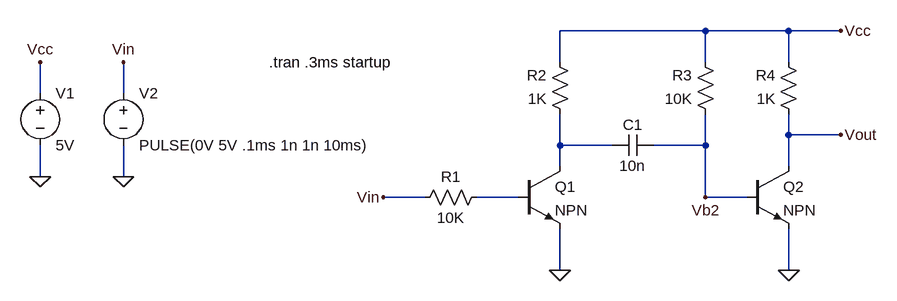
[diagram p0: schematic figure-2.11-pulse-generator-I.asc]
figure-2.11-pulse-generator-I.asc, the LTspice schematic file:
Version 4
SHEET 1 880 680
WIRE 320 -96 96 -96
WIRE 448 -96 320 -96
WIRE 528 -96 448 -96
WIRE 96 -48 96 -96
WIRE 320 -48 320 -96
WIRE 448 -48 448 -96
WIRE -704 0 -704 -48
WIRE -576 0 -576 -48
WIRE 448 64 448 32
WIRE 528 64 448 64
WIRE 96 80 96 32
WIRE 176 80 96 80
WIRE 320 80 320 32
WIRE 320 80 240 80
WIRE 96 112 96 80
WIRE 448 112 448 64
WIRE -704 128 -704 80
WIRE -576 128 -576 80
WIRE -112 160 -176 160
WIRE 32 160 -32 160
WIRE 320 160 320 80
WIRE 384 160 320 160
WIRE 96 272 96 208
WIRE 448 272 448 208
FLAG 448 272 0
FLAG 96 272 0
FLAG 528 -96 Vcc
FLAG -176 160 Vin
FLAG 528 64 Vout
FLAG -704 128 0
FLAG -576 128 0
FLAG -576 -48 Vin
FLAG -704 -48 Vcc
FLAG 320 160 Vb2
SYMBOL npn 384 112 R0
SYMATTR InstName Q2
SYMBOL res -16 144 R90
WINDOW 0 0 56 VBottom 2
WINDOW 3 32 56 VTop 2
SYMATTR InstName R1
SYMATTR Value 10K
SYMBOL res 112 48 R180
WINDOW 0 36 76 Left 2
WINDOW 3 36 40 Left 2
SYMATTR InstName R2
SYMATTR Value 1K
SYMBOL res 336 48 R180
WINDOW 0 36 76 Left 2
WINDOW 3 36 40 Left 2
SYMATTR InstName R3
SYMATTR Value 10K
SYMBOL res 464 48 R180
WINDOW 0 36 76 Left 2
WINDOW 3 36 40 Left 2
SYMATTR InstName R4
SYMATTR Value 1K
SYMBOL cap 240 64 R90
WINDOW 0 0 32 VBottom 2
WINDOW 3 32 32 VTop 2
SYMATTR InstName C1
SYMATTR Value 10n
SYMBOL npn 32 112 R0
SYMATTR InstName Q1
SYMBOL voltage -704 -16 R0
WINDOW 123 0 0 Left 0
WINDOW 39 0 0 Left 0
SYMATTR InstName V1
SYMATTR Value 5V
SYMBOL voltage -576 -16 R0
WINDOW 123 0 0 Left 0
WINDOW 39 0 0 Left 0
SYMATTR InstName V2
SYMATTR Value PULSE(0V 5V .1ms 1n 1n 10ms)
TEXT -352 -48 Left 2 !.tran .3ms startup

The netlist it stands for:
* figure-2.11-pulse-generator-I.asc
Q2 Vout Vb2 0 0 NPN
R1 N002 Vin 10K
R2 N001 Vcc 1K
R3 Vb2 Vcc 10K
R4 Vout Vcc 1K
C1 Vb2 N001 10n
Q1 N001 N002 0 0 NPN
V1 Vcc 0 5V
V2 Vin 0 PULSE(0V 5V .1ms 1n 1n 10ms)
.model NPN NPN
.model PNP PNP
.lib standard.bjt
.tran .3ms startup
.backanno
.end

* Results of the author's LTspice run, read from the files saved beside the schematic
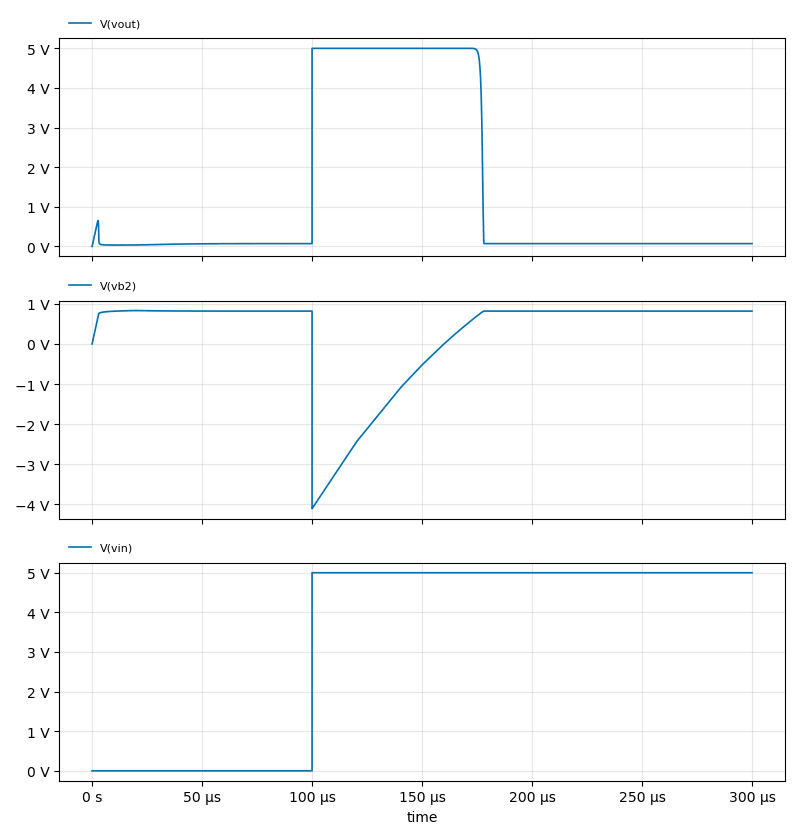
[diagram p1: Transient Analysis of figure-2.11-pulse-generator-I.asc, plotted from the saved traces]
* Transient Analysis, 1 run:
*   V(vout): min 0 V, max 5 V, average 1.339 V, rms 2.532 V, last 71.11 mV
*   V(vb2): min -4.105 V, max 832.8 mV, average 254.2 mV, rms 1.242 V, last 819 mV
*   V(vin): min 0 V, max 5 V, average 3.333 V, rms 4.082 V, last 5 V